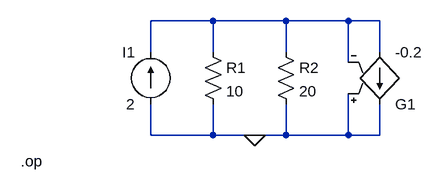
[diagram p0: schematic Draft12.asc]
Draft12.asc, the LTspice schematic file:
Version 4
SHEET 1 880 680
WIRE 144 80 48 80
WIRE 256 80 144 80
WIRE 352 80 256 80
WIRE 400 80 352 80
WIRE 48 128 48 80
WIRE 144 128 144 80
WIRE 256 128 256 80
WIRE 400 128 400 80
WIRE 352 144 352 80
WIRE 48 256 48 208
WIRE 144 256 144 208
WIRE 144 256 48 256
WIRE 208 256 144 256
WIRE 256 256 256 208
WIRE 256 256 208 256
WIRE 352 256 352 192
WIRE 352 256 256 256
WIRE 400 256 400 208
WIRE 400 256 352 256
FLAG 208 256 0
SYMBOL current 48 208 R180
WINDOW 0 24 80 Left 2
WINDOW 3 24 0 Left 2
SYMATTR InstName I1
SYMATTR Value 2
SYMBOL res 128 112 R0
SYMATTR InstName R1
SYMATTR Value 10
SYMBOL res 240 112 R0
SYMATTR InstName R2
SYMATTR Value 20
SYMBOL g 400 224 M180
SYMATTR InstName G1
SYMATTR Value -0.2
TEXT -152 296 Left 2 !.op

The netlist it stands for:
* Draft12.asc
I1 0 N001 2
R1 N001 0 10
R2 N001 0 20
G1 N001 0 0 N001 -0.2
.op
.backanno
.end